# Altium schematic sheet Power 3V3 Regulator.SchDoc: 3V3 LDO Regulator
size 292 x 193 mm; SheetNumber: 7; SheetTotal: 40
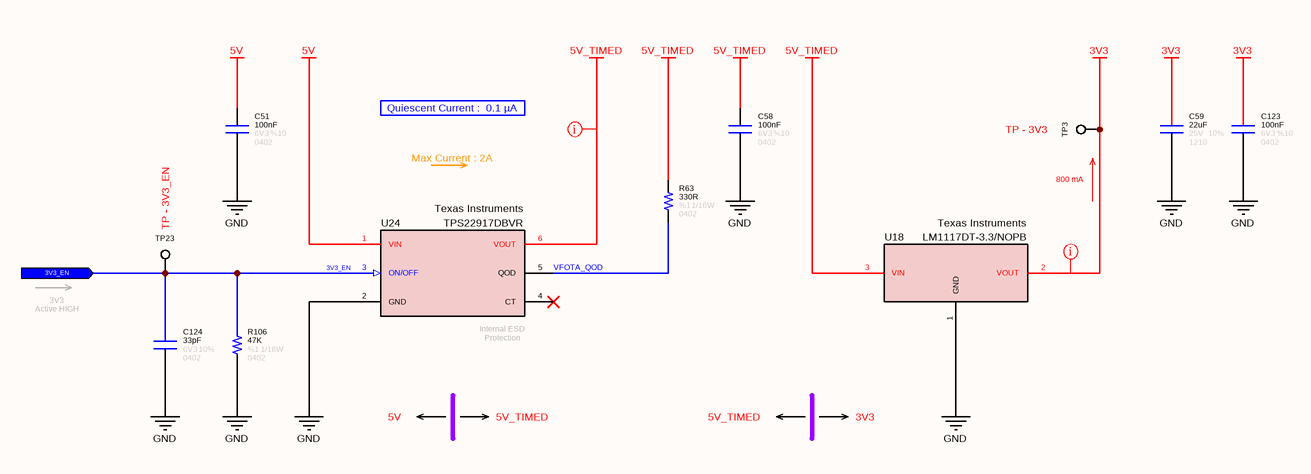
[diagram p0: Power 3V3 Regulator.SchDoc]

## Parts
C51  value 100nF  Tolerance: %10  Voltage: 6V3  Case: 0402  [CAPACITOR_0402]  (hidden comment: Capacitor - 100nF [0402] (Ceramic))
C58  value 100nF  Tolerance: %10  Voltage: 6V3  Case: 0402  [CAPACITOR_0402]  (hidden comment: Capacitor - 100nF [0402] (Ceramic))
C59  value 22uF  Tolerance: 10%  Case: 1210  Voltage: 25V  [CAPACITOR_0603]  (hidden comment: Capacitor - 22uF [1210] (Ceramic))
C123  value 100nF  Tolerance: %10  Voltage: 6V3  Case: 0402  [CAPACITOR_0402]  (hidden comment: Capacitor - 100nF [0402] (Ceramic))
C124  value 33pF  Tolerance: 10%  Case: 0402  Voltage: 6V3  [CAPACITOR_0402]  (hidden comment: Capacitor - 33pF [0402] (Ceramic))
R63  value 330R  Case: 0402  Tolerance: %1  Power: 1/16W  [RESISTOR_0402]  (hidden comment: 330R - 0402 - %1 - 1/16W)
R106  value 47K  Tolerance: %1  Case: 0402  Power: 1/16W  [RESISTOR_0402]  (hidden comment: 47K - 0402 - %1 - 1/16W)
TP3  TP - 3V3  [TP]  (no BOM)
TP23  TP - 3V3_EN  [TP]  (no BOM)
U18  Manufacturer Part Number: LM1117DT-3.3/NOPB  Manufacturer Name: Texas Instruments  [TO-252]  (hidden comment: LDO Regulator)
U24  Manufacturer Part Number: TPS22917DBVR  Manufacturer Name: Texas Instruments  [SOT-23-6]  (hidden comment: Power Switch)

## Ports
3V3_EN (in)

## Nets
3V3: C59.2 C123.2 TP3.1 U18.2(VOUT)
5V: C51.2 U24.1(VIN)
5V_TIMED: C58.2 R63.2 U18.3(VIN) U24.6(VOUT)
GND: C51.1 C58.1 C59.1 C123.1 C124.1 R106.1 U18.1(GND) U24.2(GND)
3V3_EN: C124.2 R106.2 TP23.1 U24.3(ON/OFF) ; port 3V3_EN
VFOTA_QOD: R63.1 U24.5(QOD)

Not connected (* = marked no-connect by the designer): U24 4(CT)*

## Layout directives
rule Supply Nets [Voltage = 3.300]: 3V3
rule Supply Nets [Voltage = 5.170]: 5V_TIMED

## Notes on the sheet
- Quiescent Current :  0.1 µA
- Max Current : 2A
- (near TP3) 800 mA
- 3V3
  Active HIGH
- (near U24) Internal ESD Protection
- 5V
- 5V_TIMED
- 3V3
- © 2021 All rights reserved.
  This document may not, in whole or in part, be copied, photocopied, reproduced, translated or converted to any electronic or machine readable from without prior written permission of Mehmet Günce Akkoyun.
  Engineer contact : akkoyun@me.com
- Property of
- Engineer :
- Date :
- Size :
- A4
- Time :
- Project :
- Page :
- /
- Customer :
- Product ID :
- Module ID :
- Version :
- File :
- Revision :

## Library data of the parts
C51 C58 C123 = Capacitor - 100nF [0402-6V3]: Capacitor - 100nF [0402-6V3] (Ceramic); Manufacturer Name: AVX; Manufacturer Part Number: 04026D104KAT4A; ComponentLink1Description: Mouser; ComponentLink1URL: https://www.mouser.com.tr/ProductDetail/AVX/04026D104KAT4A?qs=sGAEpiMZZMs0AnBnWHyRQPg4iYkCw7IMED%2F4kpqgf7w%3D; ComponentLink2Description: DataSheet; ComponentLink2URL: https://www.mouser.com.tr/datasheet/2/40/cx5r-776519.pdf
C59 = Capacitor - 22uF [1210-6V3]: Multilayer Ceramic Capacitors MLCC - SMD/SMT 22UF 25V 10% 1210; Manufacturer Part Number: GRM32ER71E226KE15L; Manufacturer Name: Murata
C124 = Capacitor - 33pF [0402-6V3]: Manufacturer Name: Kemet; Manufacturer Part Number: C0402C330J9RACAUTO; ComponentLink1Description: DataSheet; ComponentLink1URL: https://api.kemet.com/component-edge/download/datasheet/C0402C330J9RACAUTO.pdf; ComponentLink2Description: Mouser; ComponentLink2URL: https://www.mouser.com/Search/Refine.aspx?Keyword=80-C0402C330J9RAUTO
R63 = Resistor - 330R [0402]: Thick Film Resistors - SMD 1/16 W 330 Ohm 1%; Manufacturer Name: Vishay; Manufacturer Part Number: CRCW0402330RFKED; ComponentLink1Description: DataSheet; ComponentLink1URL: https://www.mouser.com.tr/datasheet/2/427/dcrcwe3-1762152.pdf; ComponentLink2Description: Mouser; ComponentLink2URL: https://www.mouser.com.tr/ProductDetail/Vishay-Dale/CRCW0402330RFKED?qs=sGAEpiMZZMu61qfTUdNhG2DpbjADlD3GGS6SwBlLi5Q%3D
R106 = Resistor - 47K [0402]: Thick Film Resistors - SMD 1/16 W 47 KOhm 1%; Manufacturer Name: Vishay; Manufacturer Part Number: CRCW040247K0FKED; ComponentLink1Description: DataSheet; ComponentLink1URL: https://www.mouser.com.tr/datasheet/2/427/dcrcwe3-1762152.pdf; ComponentLink2Description: Mouser; ComponentLink2URL: https://www.mouser.com.tr/ProductDetail/Vishay-Dale/CRCW040247K0FKED?qs=sGAEpiMZZMu61qfTUdNhG2DpbjADlD3GL%252B3h1elTxqU%3D
TP3 TP23 = PCB - Test Point: Test Point
U18 = IC - LM1117DT-3.3/NOPB: LDO Voltage Regulators 800MA LDO LINEAR REG; Case: TO-252-3
U24 = IC - TPS22917: Power Switch MosFet; Height: 1.45mm; ComponentLink1Description: DataSheet; ComponentLink1URL: http://www.ti.com/lit/gpn/tps22917; ComponentLink2Description: Mouser; ComponentLink2URL: https://www.mouser.com/Search/Refine.aspx?Keyword=595-TPS22917DBVR; Case: SOT-23-6